# Altium schematic sheet Sensors.SchDoc
size 300 x 219 mm; SheetNumber: 11; SheetTotal: 12
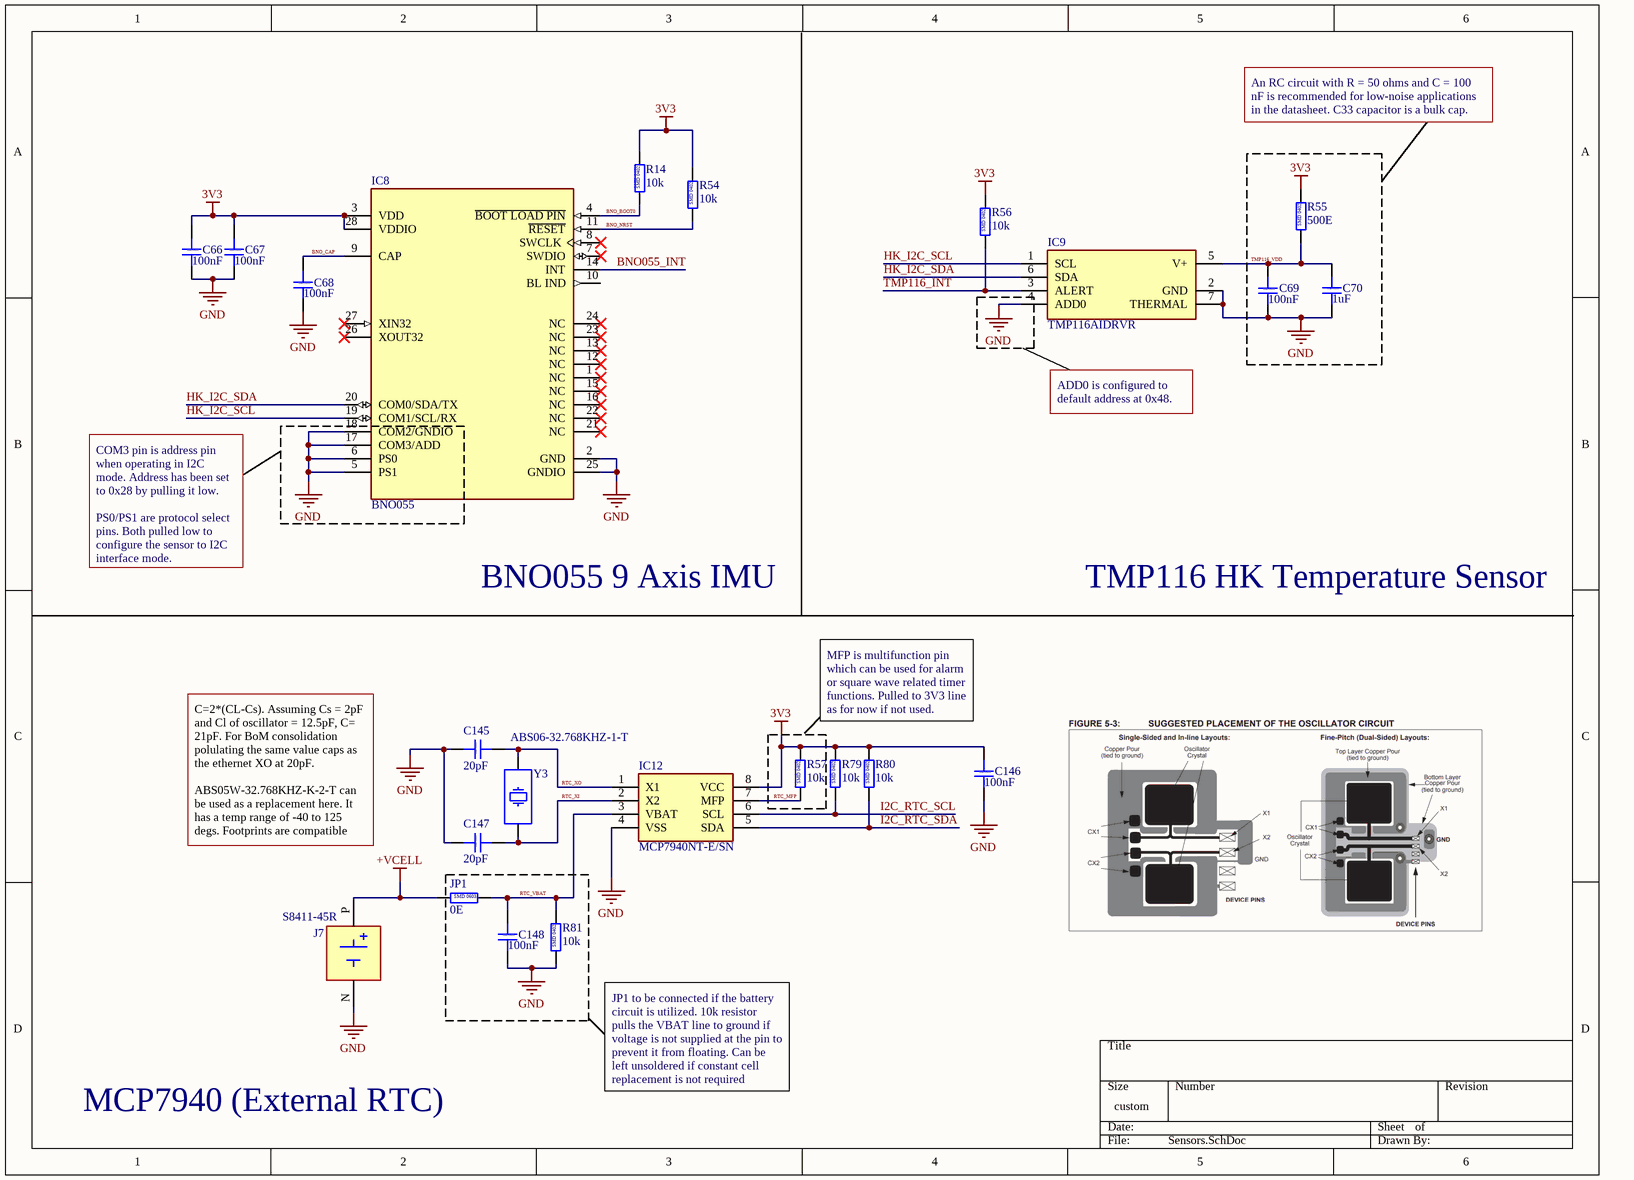
[diagram p0: Sensors.SchDoc]

## Parts
C66  100nF  [CAP_0402]
C67  100nF  [CAP_0402]
C68  100nF  [CAP_0402]
C69  100nF  [CAP_0402]
C70  1uF  [CAP_0402]
C145  20pF  [CAP_0402]
C146  100nF  [CAP_0402]
C147  20pF  [CAP_0402]
C148  100nF  [CAP_0402]
IC8  BNO055  [BNO0XX]
IC9  TMP116AIDRVR  [SON65P200X200X80-7N]
IC12  MCP7940NT-E/SN  [SOIC127P600X175-8N]
J7  S8411-45R  [HARWIN_S8411-45R]
JP1  0E  [RES_0603]
R14  10k  [RES_0402]
R54  10k  [RES_0402]
R55  500E  [RES_0402]
R56  10k  [RES_0402]
R57  10k  [RES_0402]
R79  10k  [RES_0402]
R80  10k  [RES_0402]
R81  10k  [RES_0402]
Y3  ABS06-32.768KHZ-1-T  [ABS06]

## Nets
3V3: C66.1 C67.1 C146.1 IC8.3(VDD) IC8.28(VDDIO) IC12.8(VCC) R14.2 R54.2 R55.2 R56.2 R57.2 R79.2 R80.2
+VCELL: J7.P(POS) JP1.1
GND: C66.2 C67.2 C68.2 C69.2 C70.2 C145.1 C146.2 C147.1 C148.2 IC8.2(GND) IC8.5(PS1) IC8.6(PS0) IC8.17(COM3/ADD) IC8.18(COM2/GNDIO) IC8.25(GNDIO) IC9.2(GND) IC9.4(ADD0) IC9.7(THERMAL) IC12.4(VSS) J7.N(NEG) R81.1
BNO055_INT: IC8.14(INT)
BNO_BOOT0: IC8.4(~{BOOT_LOAD_PIN}) R14.1
BNO_CAP: C68.1 IC8.9(CAP)
BNO_NRST: IC8.11(~{RESET}) R54.1
HK_I2C_SCL: IC8.19(COM1/SCL/RX) IC9.1(SCL)
HK_I2C_SDA: IC8.20(COM0/SDA/TX) IC9.6(SDA)
I2C_RTC_SCL: IC12.6(SCL) R79.1
I2C_RTC_SDA: IC12.5(SDA) R80.1
RTC_MFP: IC12.7(MFP) R57.1
RTC_VBAT: C148.1 IC12.3(VBAT) JP1.2 R81.2
RTC_XI: C147.2 IC12.2(X2) Y3.1
RTC_XO: C145.2 IC12.1(X1) Y3.2
TMP116_INT: IC9.3(ALERT) R56.1
TMP116_VDD: C69.1 C70.1 IC9.5(V+) R55.1

Not connected (* = marked no-connect by the designer): IC8 1(NC)* 7(SWDIO)* 8(SWCLK)* 10(BL_IND) 12(NC)* 13(NC)* 15(NC)* 16(NC)* 21(NC)* 22(NC)* 23(NC)* 24(NC)* 26(XOUT32)* 27(XIN32)*

## Notes on the sheet
- An RC circuit with R = 50 ohms and C = 100 nF is recommended for low-noise applications in the datasheet. C33 capacitor is a bulk cap.
- ADD0 is configured to default address at 0x48.
- COM3 pin is address pin when operating in I2C mode. Address has been set to 0x28 by pulling it low.
  PS0/PS1 are protocol select pins. Both pulled low to configure the sensor to I2C interface mode.
- BNO055 9 Axis IMU
- TMP116 HK Temperature Sensor
- MFP is multifunction pin which can be used for alarm or square wave related timer functions. Pulled to 3V3 line as for now if not used.
- C=2*(CL-Cs). Assuming Cs = 2pF and Cl of oscillator = 12.5pF, C= 21pF. For BoM consolidation polulating the same value caps as the ethernet XO at 20pF.
  ABS05W-32.768KHZ-K-2-T can be used as a replacement here. It has a temp range of -40 to 125 degs. Footprints are compatible
- MCP7940 (External RTC)
- JP1 to be connected if the battery circuit is utilized. 10k resistor pulls the VBAT line to ground if voltage is not supplied at the pin to prevent it from floating. Can be left unsoldered if constant cell replacement is not required
- (in symbol Capacitor-SMD-0402) SMD 0402
- (in symbol Resistor-SMD-0402) SMD 0402
- (in symbol Resistor-SMD-0603) SMD 0603

## Library data of the parts
C66-C70 C145-C148 = Capacitor-SMD-0402: Capacitor SMD 0402 RATED
IC9 = TMP116AIDRVR: Integrated Circuit; Manufacturer_Name: Texas Instruments; Datasheet Link: http://www.ti.com/lit/gpn/tmp116; Height: 0.8mm; Manufacturer_Part_Number: TMP116AIDRVR; Mouser Part Number: 595-TMP116AIDRVR; Mouser Price/Stock: https://www.mouser.co.uk/ProductDetail/Texas-Instruments/TMP116AIDRVR?qs=gt1LBUVyoHkC4iqK5Vip8g%3D%3D; Arrow Part Number: TMP116AIDRVR; Arrow Price/Stock: https://www.arrow.com/en/products/tmp116aidrvr/texas-instruments?utm_currency=USD&region=nac
IC12 = MCP7940NT-I_SN: Integrated Circuit; Manufacturer_Name: Microchip; Manufacturer_Part_Number: MCP7940NT-I/SN; Datasheet Link: http://www.microchip.com/mymicrochip/filehandler.aspx?ddocname=en553487; Height: 1.75mm; Mouser Part Number: 579-MCP7940NT-I/SN; Mouser Price/Stock: https://www.mouser.co.uk/ProductDetail/Microchip-Technology/MCP7940NT-I-SN?qs=o%2FJGMiCJeCObBF3PnsLA7Q%3D%3D; Arrow Part Number: MCP7940NT-I/SN; Arrow Price/Stock: https://www.arrow.com/en/products/mcp7940nt-isn/microchip-technology?region=nac
J7 = S8411-45R: Coin Cell Battery Retainer, Horizontal SMT, for CR1220 Coin Cell Batteries, Tape & Reeled; MF: Harwin; SnapEDA_Link: https://www.snapeda.com/parts/S8411-45R/Harwin+Inc./view-part/?ref=snap; Package: None; Value: *; MP: S8411-45R; Check_prices: https://www.snapeda.com/parts/S8411-45R/Harwin+Inc./view-part/?ref=eda
JP1 = Resistor-SMD-0603: Resistor SMD 0603 RATED
R14 R54-R57 R79-R81 = Resistor-SMD-0402: Resistor SMD 0402 RATED
Y3 = ABS06-32.768KHZ-1-T: Crystal or Oscillator; Manufacturer_Name: ABRACON; Datasheet Link: https://abracon.com/Resonators/ABS06.pdf; Height: 0.6mm; Manufacturer_Part_Number: ABS06-32.768KHZ-1-T; Mouser Part Number: 815-ABS06-32.7K-1-T; Mouser Price/Stock: https://www.mouser.co.uk/ProductDetail/ABRACON/ABS06-32.768KHZ-1-T?qs=3LVMET7lfiOVpH4K9yAPuw%3D%3D; Arrow Part Number: ABS06-32.768KHZ-1-T; Arrow Price/Stock: https://www.arrow.com/en/products/abs06-32.768khz-1-t/abracon?utm_currency=USD&region=nac